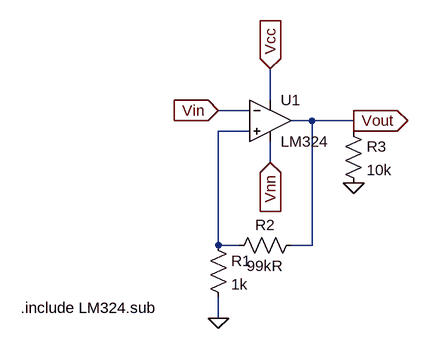
[diagram p0: schematic noninvertCirc.asc]
noninvertCirc.asc, the LTspice schematic file:
Version 4.1
SHEET 1 880 680
WIRE 192 80 192 32
WIRE 160 96 112 96
WIRE 256 112 224 112
WIRE 320 112 256 112
WIRE 160 128 112 128
WIRE 320 128 320 112
WIRE 192 176 192 144
WIRE 112 304 112 128
WIRE 144 304 112 304
WIRE 256 304 256 112
WIRE 256 304 224 304
WIRE 112 416 112 384
FLAG 320 208 0
FLAG 112 416 0
FLAG 112 96 Vin
IOPIN 112 96 In
FLAG 320 112 Vout
IOPIN 320 112 Out
FLAG 192 176 Vnn
IOPIN 192 176 In
FLAG 192 32 Vcc
IOPIN 192 32 In
SYMBOL LM324 192 112 R0
SYMATTR InstName U1
SYMBOL res 96 288 R0
SYMATTR InstName R1
SYMATTR Value 1k
SYMBOL res 240 288 R90
WINDOW 0 0 56 VBottom 2
WINDOW 3 32 56 VTop 2
SYMATTR InstName R2
SYMATTR Value 99kR
SYMBOL res 304 112 R0
SYMATTR InstName R3
SYMATTR Value 10k
TEXT -192 400 Left 2 !.include LM324.sub

The netlist it stands for:
* noninvertCirc.asc
* U1: LM324 (symbol LM324 not available, pins judged from their places): In+=N001 In-=Vin V+=Vcc V-=Vnn OUT=Vout
R1 N001 0 1k
R2 Vout N001 99kR
R3 Vout 0 10k
.include LM324.sub
.backanno
.end